# Altium schematic sheet Sheet_1_2025-10-18.schdoc
size 237 x 138 mm
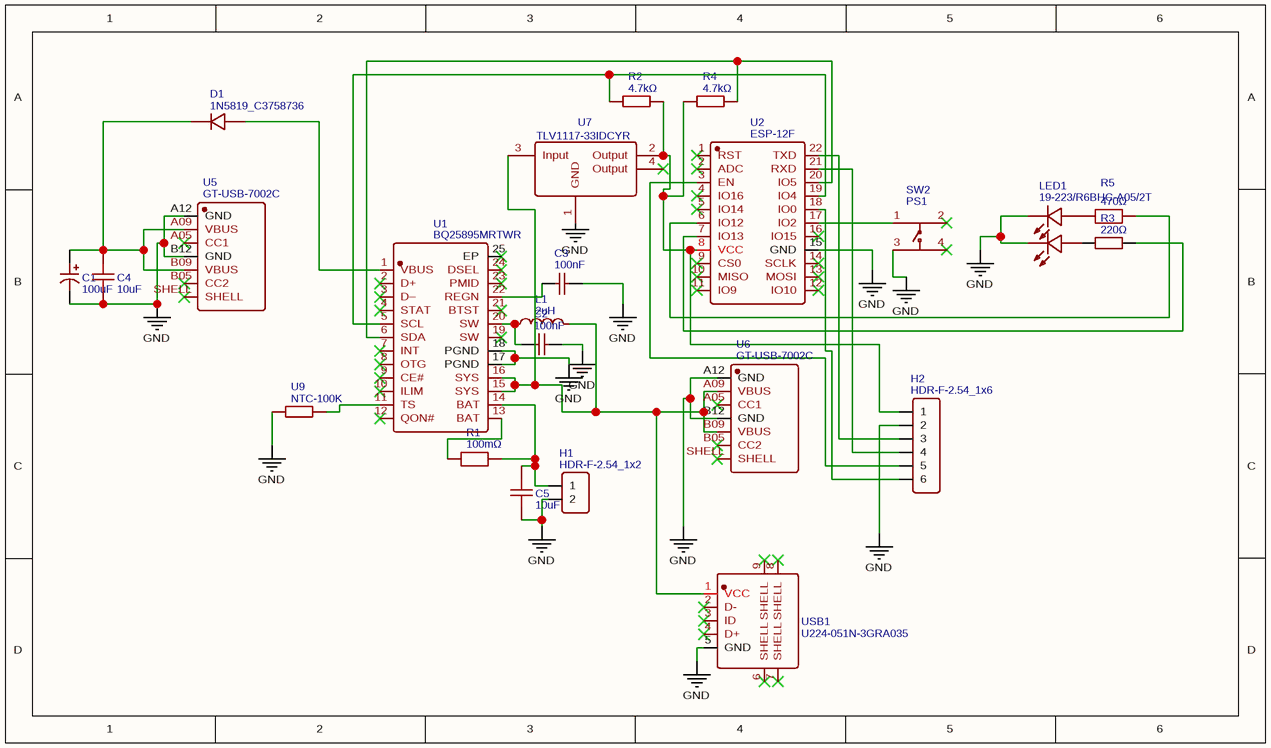
[diagram p0: Sheet_1_2025-10-18.schdoc]

## Parts
C1  100uF  [CAP-SMD_BD6.3-L6.6-W6.6-LS7.4-FD]
C2  100nF  [C0402]
C3  100nF  [C0402]
C4  10uF  [C0805]
C5  10uF  [C0805]
D1  1N5819_C3758736  [DO-41_BD2.4-L4.7-P8.70-D0.8-FD]
H1  HDR-F-2.54_1x2  [HDR-F-2.54_1X2]
H2  HDR-F-2.54_1x6  [HDR-F-2.54_1X6]
L1  2uH  [IND-SMD_L6.9-W6.9-LS7.0]
LED1  19-223/R6BHC-A05/2T  [LED-ARRAY-SMD_4P-L1.6-W1.3-BR-FD]
R1  100mΩ  [RES-SMD_L6.4-W3.2-R2512]
R2  4.7kΩ  [R0603]
R3  220Ω  [R0603]
R4  4.7kΩ  [R0603]
R5  470Ω  [R0805]
SW2  PS1  [SW-SMD_4P-L6.2-W6.2-P4.50-LS8.6]
U1  BQ25895MRTWR  [WQFN-24_L4.0-W4.0-P0.50-TL-EP2.7]
U2  ESP-12F  [WIRELM-SMD_ESP-12F]
U5  GT-USB-7002C  [USB-C-SMD_GT-USB-7002C]
U6  GT-USB-7002C  [USB-C-SMD_GT-USB-7002C]
U7  TLV1117-33IDCYR  [SOT-223-4_L6.5-W3.5-P2.30-LS7.0-BR]
U9  NTC-100K  [RES-TH_NTC-100K]
USB1  U224-051N-3GRA035  [USB-A-TH_U224-051N-3GRA035]

## Nets
GND: C1.2 C2.2 C3.2 C4.2 C5.2 H1.2 H2.2 LED1.2(C) LED1.4(C) SW2.3 U1.17(PGND) U1.18(PGND) U2.15(GND) U5.A12(GND) U5.B12(GND) U6.A12(GND) U6.B12(GND) U7.1(GND) U9.1 USB1.5(GND)
NetC1_1: C1.1 C4.1 D1.2(K) U5.A09(VBUS) U5.B09(VBUS)
NetC2_1: C2.1 L1.1 U1.20(SW)
NetC3_1: C3.1 U1.22(REGN)
NetC5_1: C5.1 H1.1 R1.2 U1.14(BAT)
NetD1_1: D1.1(A) U1.1(VBUS)
NetH2_1: H2.1 R2.2 R4.1 U2.8(VCC) U7.2(Output)
NetH2_3: H2.3 U2.22(TXD)
NetH2_4: H2.4 U2.21(RXD)
NetH2_5: H2.5 U2.3(EN)
NetH2_6: H2.6 U2.18(IO0)
NetL1_2: L1.2 U1.15(SYS) U1.16(SYS) U6.A09(VBUS) U6.B09(VBUS) U7.3(Input) USB1.1(VCC)
NetLED1_1: LED1.1(A) R3.1
NetLED1_3: LED1.3(A) R5.1
NetR1_1: R1.1 U1.13(BAT)
NetR2_1: R2.1 U1.5(SCL) U2.19(IO4)
NetR3_2: R3.2 U2.7(IO13)
NetR4_2: R4.2 U1.6(SDA) U2.20(IO5)
NetR5_2: R5.2 U2.6(IO12)
NetSW2_1: SW2.1 U2.17(IO2)
NetU1_11: U1.11(TS) U9.2

Not connected (* = marked no-connect by the designer): SW2 2* 4*; U1 2(D+)* 3(D–)* 4(STAT)* 7(INT)* 8(OTG)* 9(CE#)* 10(ILIM)* 12(QON#)* 19(SW)* 21(BTST)* 23(PMID)* 24(DSEL)* 25(EP)*; U2 1(RST)* 2(ADC)* 4(IO16)* 5(IO14)* 9(CS0)* 10(MISO)* 11(IO9)* 12(IO10)* 13(MOSI)* 14(SCLK)* 16(IO15)*; U5 A05(CC1)* B05(CC2)* SHELL*; U6 A05(CC1)* B05(CC2)* SHELL*; U7 4(Output)*; USB1 2(D-)* 3(ID)* 4(D+)* 6(SHELL)* 7(SHELL)* 8(SHELL)* 9(SHELL)*

## Library data of the parts
C1 = 100uF: Manufacturer: KNSCHA(科尼盛); Manufacturer Part: RVT100UF35V67RV0034; nameAlias: Value; Contributor: LCSC; Supplier: LCSC; Supplier Part: C2836442; JLCPCB Part Class: Extended Part; spicePre: C; spiceSymbolName: RVT100UF35V67RV0034
C2 C3 = 100nF: Manufacturer: FH(风华); Manufacturer Part: 0402B104K250NT; nameAlias: Value; Supplier: LCSC; Supplier Part: C56392; JLCPCB Part Class: Extended Part; spicePre: C; spiceSymbolName: 0402B104K250NT
C4 C5 = 10uF: Manufacturer Part: CL21A106KAYNNNE; Manufacturer: SAMSUNG(三星); nameAlias: Value; Supplier: LCSC; Supplier Part: C15850; JLCPCB Part Class: Basic Part; spicePre: C; spiceSymbolName: CL21A106KAYNNNE
D1 = 1N5819_C3758736: Manufacturer: Taiwan Semiconductor(台湾半导体); Manufacturer Part: 1N5819; Contributor: lcsc; Supplier: LCSC; Supplier Part: C3758736; spicePre: D; spiceSymbolName: 1N5819_C3758736
H1 = HDR-F-2.54_1x2: Contributor: LCEDA_Lib; Supplier Part: C49661; Supplier: LCSC; spicePre: H; spiceSymbolName: HDR-F-2.54_1x2
H2 = HDR-F-2.54_1x6: Contributor: LCEDA_Lib; Supplier Part: C40877; Supplier: LCSC; spicePre: H; spiceSymbolName: HDR-F-2.54_1x6
L1 = 2uH: Manufacturer: KOHERelec(科或); Manufacturer Part: FHC7030-2R0M; nameAlias: Value; Contributor: LCSC; Supplier: LCSC; Supplier Part: C2761948; JLCPCB Part Class: Extended Part; spicePre: L; spiceSymbolName: FHC7030-2R0M
LED1 = 19-223/R6BHC-A05/2T: Manufacturer: EVERLIGHT(亿光); Contributor: LCSC; Supplier: LCSC; Supplier Part: C131286; Manufacturer Part: 19-223/R6BHC-A05/2T; JLCPCB Part Class: Extended Part; spicePre: L; spiceSymbolName: 19-223/R6BHC-A05/2T
R1 = 100mΩ: Manufacturer: Milliohm(毫欧); Manufacturer Part: HoJLR2512-3W-100mR-1%; nameAlias: Value; Contributor: lcsc; Supplier: LCSC; Supplier Part: C2903476; JLCPCB Part Class: Extended Part; spicePre: R; spiceSymbolName: HOJLR2512-3W-100MR-1%
R2 R4 = 4.7kΩ: Manufacturer: KOA; Manufacturer Part: RN73H1JTTD4701B25; nameAlias: Value; Contributor: LCSC; Supplier: LCSC; Supplier Part: C186202; JLCPCB Part Class: Extended Part; spicePre: R; spiceSymbolName: RN73H1JTTD4701B25
R3 = 220Ω: Manufacturer: UNI-ROYAL(厚声); Manufacturer Part: 0603WAF2200T5E; nameAlias: Value; Supplier: LCSC; Supplier Part: C22962; JLCPCB Part Class: Basic Part; spicePre: R; spiceSymbolName: 0603WAF2200T5E
R5 = 470Ω: Manufacturer: FOJAN(富捷); Manufacturer Part: FRC0805J471 TS; nameAlias: Value; Contributor: lcsc; Supplier: LCSC; Supplier Part: C2907329; JLCPCB Part Class: Extended Part; spicePre: U; spiceSymbolName: FRC0805J471 TS
SW2 = PS1: Manufacturer: 韩国韩荣; Manufacturer Part: K2-1157SP-I4SW-01; Contributor: mubashirimran41; Supplier: LCSC; Supplier Part: C2909692; JLCPCB Part Class: Extended Part; spicePre: S; spiceSymbolName: K2-1157SP-I4SW-04
U1 = BQ25895MRTWR: Manufacturer: TI(德州仪器); Contributor: LCSC; Supplier: LCSC; Supplier Part: C485917; Manufacturer Part: BQ25895MRTWR; JLCPCB Part Class: Extended Part; spicePre: U; spiceSymbolName: BQ25895MRTWR
U2 = ESP-12F: Manufacturer: DOIT(四博智联); Contributor: lcsc; Supplier: LCSC; Supplier Part: C19949064; Manufacturer Part: ESP-12F; JLCPCB Part Class: Extended Part; spicePre: U; spiceSymbolName: ESP-12F
U5 U6 = GT-USB-7002C: Manufacturer: G-Switch(品赞); Contributor: lcsc; Supplier: LCSC; Supplier Part: C5117884; Manufacturer Part: GT-USB-7002C; JLCPCB Part Class: Extended Part; spicePre: U; spiceSymbolName: GT-USB-7002C
U7 = TLV1117-33IDCYR: Manufacturer: TI(德州仪器); Supplier: LCSC; Manufacturer Part: TLV1117-33IDCYR; Supplier Part: C37359; JLCPCB Part Class: Extended Part; spicePre: U; spiceSymbolName: TLV1117-33IDCYR
U9 = NTC-100K: Manufacturer: null; Contributor: lcsc; Supplier: LCSC; Supplier Part: C9900024696; Manufacturer Part: NTC-100K; JLCPCB Part Class: Extended Part; spicePre: U; spiceSymbolName: NTC-100K
USB1 = U224-051N-3GRA035: Manufacturer: XKB Connectivity(中国星坤); Contributor: lcsc; Supplier: LCSC; Supplier Part: C2689740; Manufacturer Part: U224-051N-3GRA035; JLCPCB Part Class: Extended Part; spicePre: U; spiceSymbolName: U224-051N-3GRA035